# Altium schematic sheet StratoChovy.SchDoc: Top Sheet
size A3; Author: Tim Vrakas; CompanyName: SSI; Revision: 2.1; SheetNumber: 1; SheetTotal: 6; DocumentName: Top Sheet
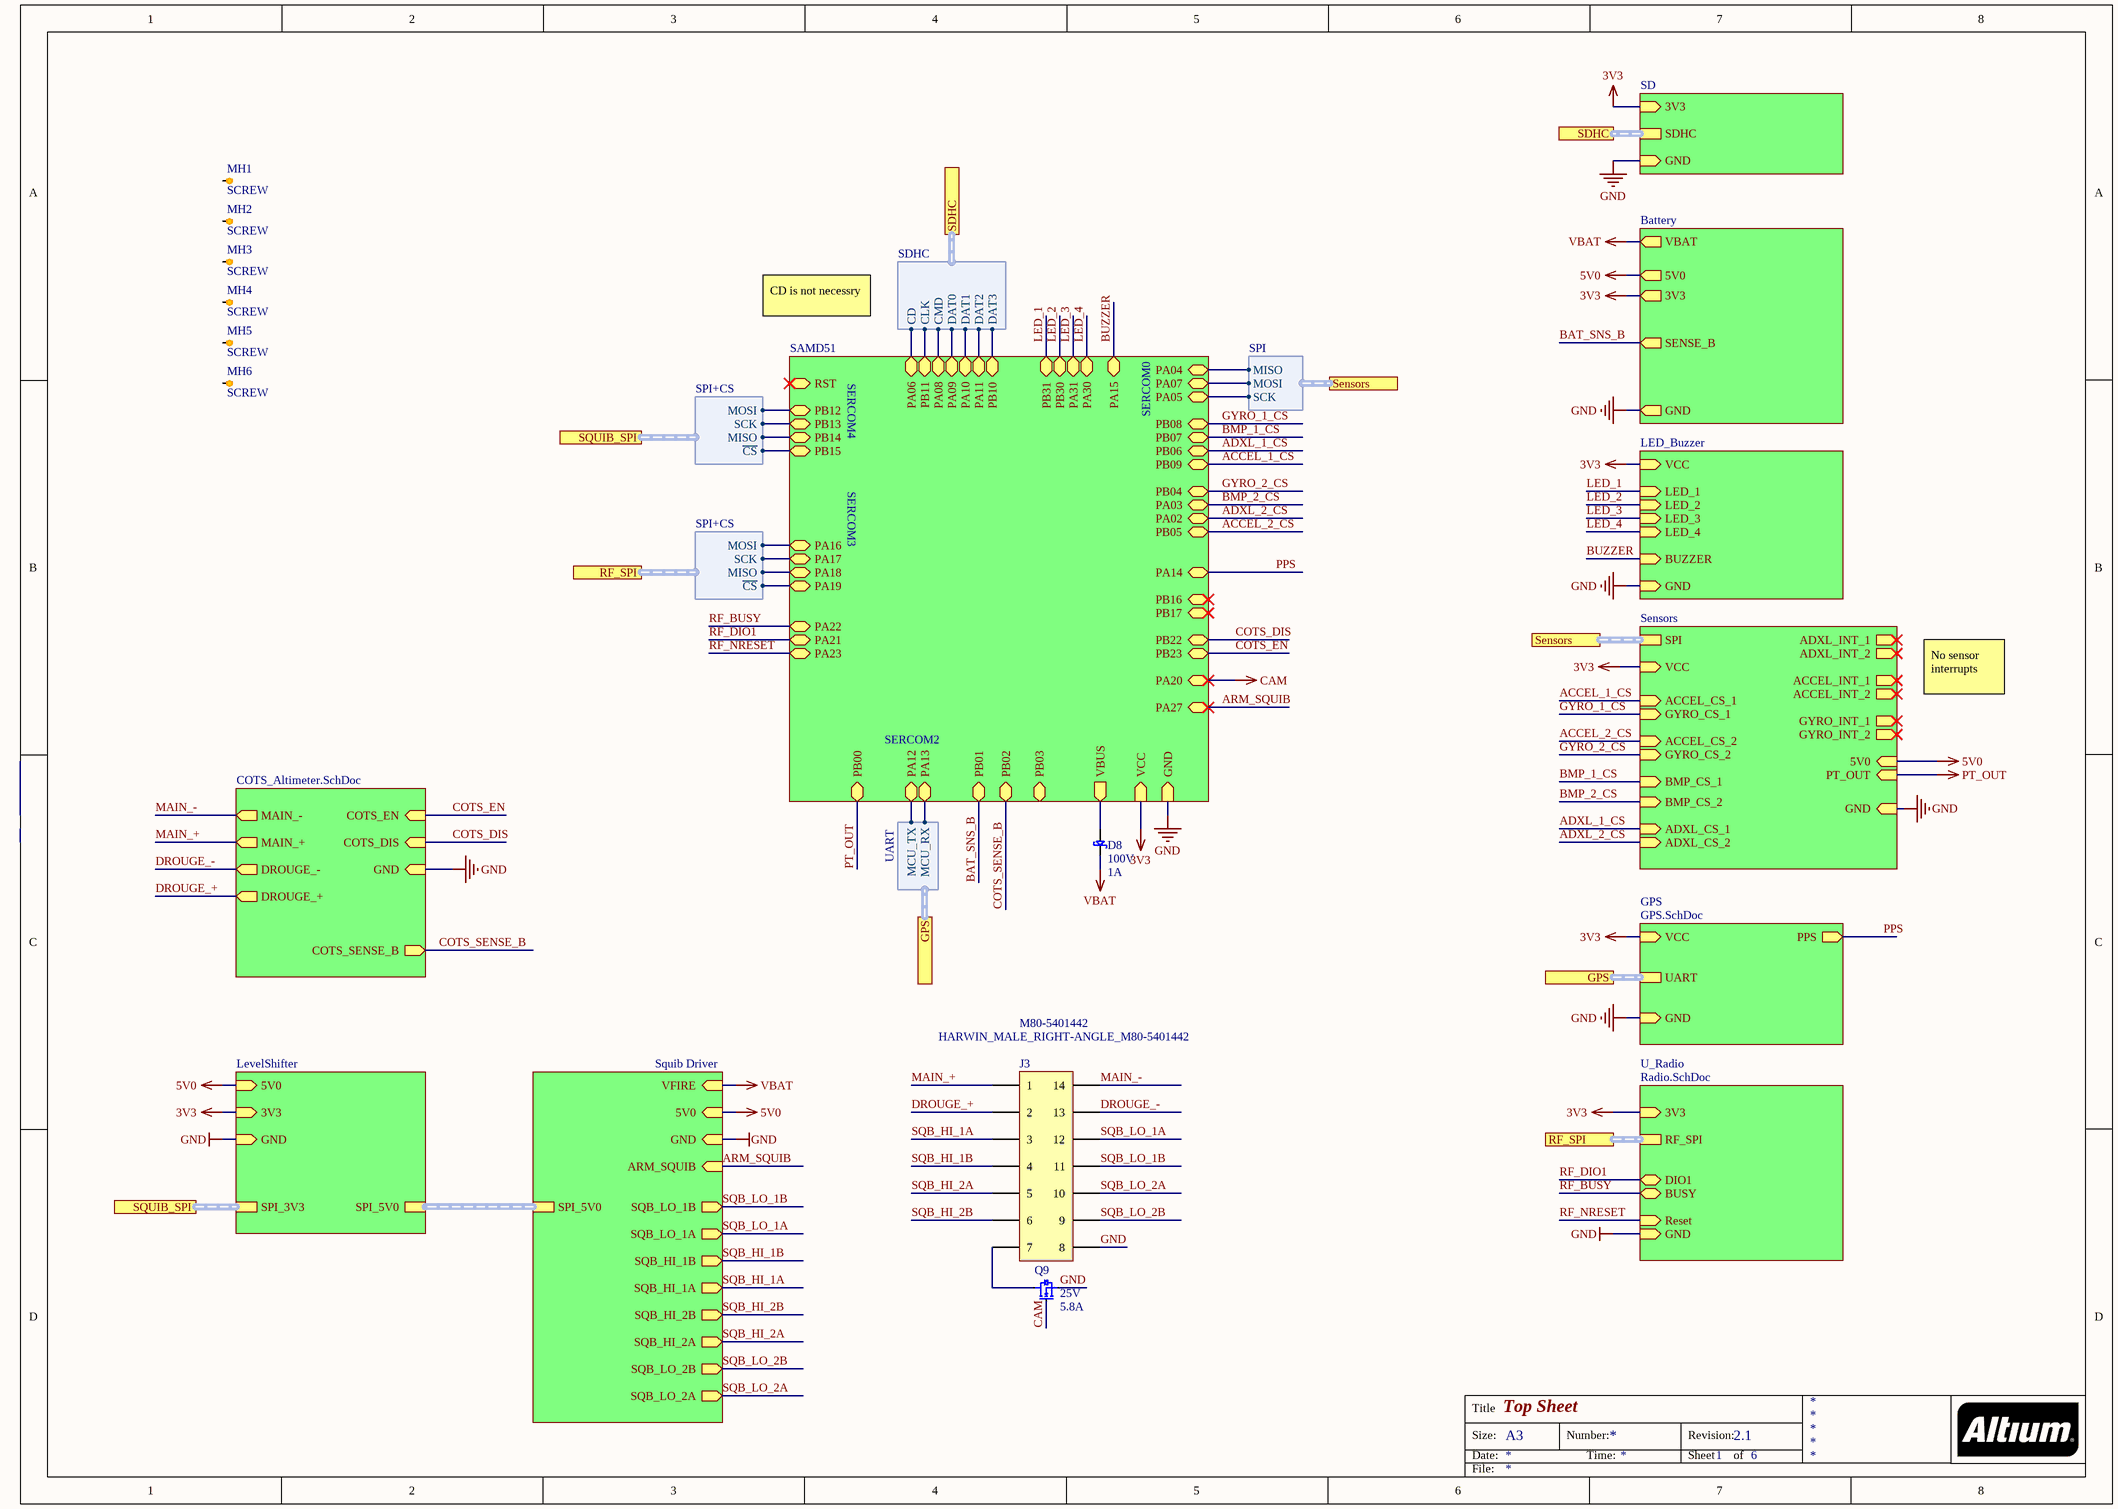
[diagram p0: StratoChovy.SchDoc]

## Parts
D8  Voltage - DC Reverse (Vr) (Max): 100V  Current - Average Rectified (Io): 1A  [SMA]  (hidden comment: Diode_CD214A-B1100LF)
J3  HARWIN_MALE_RIGHT-ANGLE_M80-5401442  Manufacturer Part Number: M80-5401442  [HARWIN_M80-5401442]
MH1  SCREW  [SCREW_M3]
MH2  SCREW  [SCREW_M3]
MH3  SCREW  [SCREW_M3]
MH4  SCREW  [SCREW_M3]
MH5  SCREW  [SCREW_M3]
MH6  SCREW  [SCREW_M3]
Q9  Drain to Source Voltage (Vdss): 25V  Current - Continuous Drain (Id) @ 25° C: 5.8A  [3SOT23]  (hidden comment: NFET_IRFML8244TRPBF)

## Sub-sheets
Battery = Battery_Management: GND (out), 3V3 (out), VBAT (out), SENSE_B (out), 5V0 (out)
COTS_Altimeter = COTS_Altimeter.SchDoc: COTS_EN (in), COTS_DIS (in), GND (in), MAIN_- (out), MAIN_+ (out), DROUGE_- (out), DROUGE_+ (out), COTS_SENSE_B (out)
GPS = GPS.SchDoc: UART (harness UART), VCC (in), GND (in), PPS (out)
LED_Buzzer = Blink_Blink_Beep_Boop: LED_1 (in), LED_2 (in), LED_3 (in), LED_4 (in), BUZZER (in), GND (in), VCC (in)
LevelShifter = LevelShifter.SchDoc: SPI_3V3 (harness SPI+CS), SPI_5V0 (harness SPI+CS), 3V3 (in), 5V0 (in), GND (in)
SAMD51 = SAMD51.SchDoc: PA12 (bidir), PA13 (bidir), PA05 (bidir), PA07 (bidir), PA04 (bidir), PA06 (bidir), PB11 (bidir), PA08 (bidir), PA09 (bidir), PA10 (bidir), PA11 (bidir), PB10 (bidir), PB12 (bidir), PB13 (bidir), PA22 (bidir), PA23 (bidir), PA19 (bidir), PA17 (bidir), PA21 (bidir), PB08 (bidir), PB07 (bidir), PB06 (bidir), PB09 (bidir), PB04 (bidir), PA03 (bidir), PA02 (bidir), PB05 (bidir), PB30 (bidir), PA31 (bidir), PA30 (bidir), PB31 (bidir), PB16 (bidir), PA14 (bidir), PB17 (bidir), PB23 (bidir), PB22 (bidir), PB02 (bidir), PB03 (bidir), PA18 (bidir), GND (in), VCC (in), VBUS (out), PB14 (bidir), PB15 (bidir), PA15 (bidir), RST (bidir), PA16 (bidir), PB01 (bidir), PB00 (bidir), PA20 (bidir), PA27 (bidir)
SD = SD.SchDoc: SDHC (harness SDHC), GND (in), 3V3 (in)
Sensors = Sensors.SchDoc: SPI (harness SPI), GYRO_CS_1 (in), BMP_CS_1 (in), ADXL_CS_1 (in), ACCEL_CS_1 (in), ACCEL_INT_1 (out), ACCEL_INT_2 (out), ADXL_INT_1 (out), GYRO_INT_1 (out), GYRO_INT_2 (out), GND (in), VCC (in), GYRO_CS_2 (in), ACCEL_CS_2 (in), BMP_CS_2 (in), ADXL_CS_2 (in), ADXL_INT_2 (out), 5V0 (in), PT_OUT (in)
Squib Driver = MC33797.SchDoc: VFIRE (in), SPI_5V0 (harness SPI+CS), GND (in), 5V0 (in), SQB_HI_2B (out), SQB_LO_1B (out), SQB_LO_1A (out), SQB_HI_1B (out), SQB_HI_1A (out), SQB_HI_2A (out), SQB_LO_2B (out), SQB_LO_2A (out), ARM_SQUIB (in)
U_Radio = Radio.SchDoc: DIO1 (bidir), Reset (in), RF_SPI (harness SPI+CS), 3V3 (in), GND (in), BUSY (bidir)

## Ports
GPS (harness UART), RF_SPI (harness SPI+CS), SDHC (harness SDHC), Sensors (harness SPI), SQUIB_SPI (harness SPI+CS)

## Harnesses
UART: MCU_TX, MCU_RX
SPI: MISO, MOSI, SCK
SDHC: CD, CLK, CMD, DAT0, DAT1, DAT2, DAT3
SPI+CS: MOSI, SCK, MISO, ~{CS}

## Nets
3V3: sheet Sensors/VCC, sheet Battery/3V3, sheet LED_Buzzer/VCC, sheet SAMD51/VCC, sheet SD/3V3, sheet GPS/VCC, sheet U_Radio/3V3, sheet LevelShifter/3V3
5V0: sheet Sensors/5V0, sheet Battery/5V0, sheet Squib Driver/5V0, sheet LevelShifter/5V0
CAM: Q9.1 ; sheet SAMD51/PA20
GND: J3.8 Q9.2 ; sheet Sensors/GND, sheet Battery/GND, sheet LED_Buzzer/GND, sheet SAMD51/GND, sheet SD/GND, sheet GPS/GND, sheet COTS_Altimeter/GND, sheet U_Radio/GND, sheet Squib Driver/GND, sheet LevelShifter/GND
PT_OUT: sheet Sensors/PT_OUT, sheet SAMD51/PB00
VBAT: D8.2(Cathode) ; sheet Battery/VBAT, sheet Squib Driver/VFIRE
ACCEL_1_CS: sheet Sensors/ACCEL_CS_1, sheet SAMD51/PB09
ACCEL_2_CS: sheet Sensors/ACCEL_CS_2, sheet SAMD51/PB05
ADXL_1_CS: sheet Sensors/ADXL_CS_1, sheet SAMD51/PB06
ADXL_2_CS: sheet Sensors/ADXL_CS_2, sheet SAMD51/PA02
ARM_SQUIB: sheet SAMD51/PA27, sheet Squib Driver/ARM_SQUIB
BAT_SNS_B: sheet Battery/SENSE_B, sheet SAMD51/PB01
BMP_1_CS: sheet Sensors/BMP_CS_1, sheet SAMD51/PB07
BMP_2_CS: sheet Sensors/BMP_CS_2, sheet SAMD51/PA03
BUZZER: sheet LED_Buzzer/BUZZER, sheet SAMD51/PA15
COTS_DIS: sheet SAMD51/PB22, sheet COTS_Altimeter/COTS_DIS
COTS_EN: sheet SAMD51/PB23, sheet COTS_Altimeter/COTS_EN
COTS_SENSE_B: sheet SAMD51/PB02, sheet COTS_Altimeter/COTS_SENSE_B
DROUGE_+: J3.2 ; sheet COTS_Altimeter/DROUGE_+
DROUGE_-: J3.13 ; sheet COTS_Altimeter/DROUGE_-
GYRO_1_CS: sheet Sensors/GYRO_CS_1, sheet SAMD51/PB08
GYRO_2_CS: sheet Sensors/GYRO_CS_2, sheet SAMD51/PB04
LED_1: sheet LED_Buzzer/LED_1, sheet SAMD51/PB31
LED_2: sheet LED_Buzzer/LED_2, sheet SAMD51/PB30
LED_3: sheet LED_Buzzer/LED_3, sheet SAMD51/PA31
LED_4: sheet LED_Buzzer/LED_4, sheet SAMD51/PA30
MAIN_+: J3.1 ; sheet COTS_Altimeter/MAIN_+
MAIN_-: J3.14 ; sheet COTS_Altimeter/MAIN_-
PPS: sheet SAMD51/PA14, sheet GPS/PPS
RF_BUSY: sheet SAMD51/PA22, sheet U_Radio/BUSY
RF_DIO1: sheet SAMD51/PA21, sheet U_Radio/DIO1
RF_NRESET: sheet SAMD51/PA23, sheet U_Radio/Reset
SQB_HI_1A: J3.3 ; sheet Squib Driver/SQB_HI_1A
SQB_HI_1B: J3.4 ; sheet Squib Driver/SQB_HI_1B
SQB_HI_2A: J3.5 ; sheet Squib Driver/SQB_HI_2A
SQB_HI_2B: J3.6 ; sheet Squib Driver/SQB_HI_2B
SQB_LO_1A: J3.12 ; sheet Squib Driver/SQB_LO_1A
SQB_LO_1B: J3.11 ; sheet Squib Driver/SQB_LO_1B
SQB_LO_2A: J3.10 ; sheet Squib Driver/SQB_LO_2A
SQB_LO_2B: J3.9 ; sheet Squib Driver/SQB_LO_2B
NetD8_1: D8.1(Anode) ; sheet SAMD51/VBUS
NetJ3_7: J3.7 Q9.3
(unnamed): sheet SAMD51/PA12, port GPS.MCU_TX
(unnamed): sheet SAMD51/PA13, port GPS.MCU_RX
(unnamed): sheet SAMD51/PA05, port Sensors.SCK
(unnamed): sheet SAMD51/PA07, port Sensors.MOSI
(unnamed): sheet SAMD51/PA04, port Sensors.MISO
(unnamed): sheet SAMD51/PA06, port SDHC.CD
(unnamed): sheet SAMD51/PB11, port SDHC.CLK
(unnamed): sheet SAMD51/PA08, port SDHC.CMD
(unnamed): sheet SAMD51/PA09, port SDHC.DAT0
(unnamed): sheet SAMD51/PA10, port SDHC.DAT1
(unnamed): sheet SAMD51/PA11, port SDHC.DAT2
(unnamed): sheet SAMD51/PB10, port SDHC.DAT3
(unnamed): sheet SAMD51/PB12, port SQUIB_SPI.MOSI
(unnamed): sheet SAMD51/PB13, port SQUIB_SPI.SCK
(unnamed): sheet SAMD51/PA19, port RF_SPI.~{CS}
(unnamed): sheet SAMD51/PA17, port RF_SPI.SCK
(unnamed): sheet SAMD51/PA18, port RF_SPI.MISO
(unnamed): sheet SAMD51/PB14, port SQUIB_SPI.MISO
(unnamed): sheet SAMD51/PB15, port SQUIB_SPI.~{CS}
(unnamed): sheet SAMD51/PA16, port RF_SPI.MOSI

Not connected (* = marked no-connect by the designer): MH1 1; MH2 1; MH3 1; MH4 1; MH5 1; MH6 1

## Buses and harness runs
harness port GPS = sheet GPS/UART
harness port RF_SPI = sheet U_Radio/RF_SPI
harness port SDHC = sheet SD/SDHC
harness port Sensors = sheet Sensors/SPI
harness port SQUIB_SPI = sheet LevelShifter/SPI_3V3
harness sheet LevelShifter/SPI_5V0 = sheet Squib Driver/SPI_5V0

## Notes on the sheet
- CD is not necessry
- SERCOM4
- SERCOM0
- SERCOM3
- No sensor interrupts
- SERCOM2
- Title
- Size:
- Date:
- A3
- Number:
- Time:
- Revision:
- Sheet
- of
- File:

## Library data of the parts
D8 = CMP-033-0060-1: Diode Schottky 100V 1A Surface Mount SMA (DO-214AC); Manufacturer: Bourns Inc.; Voltage - Forward (Vf) (Max) @ If: 790mV @ 1A; Current - Reverse Leakage @ Vr: 500µA @ 100V; Speed: Fast Recovery =< 500ns, > 200mA (Io); Capacitance @ Vr, F: 30pF @ 4V, 1MHz; Design Item ID: Diode_CD214A-B1100LF; Part Status: Active; Source: diode.SchLib; Stock 1: 21982; Manufacturer Part Number: CD214A-B1100LF; Diode Type: Schottky; Reverse Recovery Time (trr): -; Operating Temperature - Junction: -55°C ~ 125°C; RoHS: RoHS Compliant; Supplier Device Package: SMA (DO-214AC); Package / Case: DO-214AC, SMA; Packaging: Cut Tape (CT); ComponentLink1Description: http://www.bourns.com/docs/Product-Datasheets/CD214-B120_B1100.pdf; Mounting Type: Surface Mount; Pricing 1: 1=0.54, 10=0.42, 25=0.3544, 100=0.2888, 250=0.2392, 500=0.1976, 1000=0.148, 2500=0.136 (USD); ComponentLink1URL: http://www.bourns.com/docs/Product-Datasheets/CD214-B120_B1100.pdf
J3 = CMP-030-0115-1: 7+7 POS R/A MALE 3mm TAIL W/JS TIN; Manufacturer: Harwin; Pitch: 2mm; Number of poles: 14; Wire connection method: Solder; Number of arrays: 2; Source: connector.SchLib; ComponentLink1URL: https://datasheet.ciiva.com/11751/0900766b80d93463-11751065.pdf; ComponentLink2Description: https://datasheet.ciiva.com/733/m80-540-733786.pdf; Height: 6.05mm; Stock 1: 61; ComponentLink1Description: https://datasheet.ciiva.com/11751/0900766b80d93463-11751065.pdf; ComponentLink3URL: https://datasheet.ciiva.com/41451/001233329-da-01-en-stiftleiste-einbau-gewinkelt-m80-5401442-41451405.pdf; ComponentLink2URL: https://datasheet.ciiva.com/733/m80-540-733786.pdf; Design Item ID: HARWIN_MALE_RIGHT-ANGLE_M80-5401442; Pricing 1: 1=18.11, 10=16.81, 50=14.66, 100=12.93, 1000=11.81, 10000=11.81 (USD); ComponentLink3Description: https://datasheet.ciiva.com/41451/001233329-da-01-en-stiftleiste-einbau-gewinkelt-m80-5401442-41451405.pdf; Length: 24mm
MH1-MH6 = CMP-054-0000-1: Design Item ID: SCREW; Source: mechanical.SchLib
Q9 = CMP-078-0046-1: MOSFET N-CH 25V 5.8A SOT23; Manufacturer: International Rectifier; FET Type: MOSFET N-Channel, Metal Oxide; FET Feature: Logic Level Gate; Rds On (Max) @ Id, Vgs: 24 mOhm @ 5.8A, 10V; Vgs(th) (Max) @ Id: 2.35V @ 10µA; Gate Charge (Qg) @ Vgs: 5.4nC @ 10V; Input Capacitance (Ciss) @ Vds: 430pF @ 10V; Power - Max: 1.25W; Manufacturer Part Number: IRFML8244TRPBF; RoHS: RoHS Compliant; Stock 1: 13542; Pricing 1: 1=0.41, 10=0.23, 100=0.1491, 250=0.13548, 500=0.1219, 1000=0.11411 (USD); Mounting Type: Surface Mount; Package / Case: TO-236-3, SC-59, SOT-23-3; Supplier Device Package: SOT-23; Packaging: Cut Tape (CT); ComponentLink1URL: http://www.irf.com/product-info/datasheets/data/irfml8244pbf.pdf; ComponentLink1Description: Datasheet; Design Item ID: NFET_IRFML8244TRPBF; Source: transistor_fet.SchLib